# EAGLE design lightplay2 (EAGLE 7.2.0)
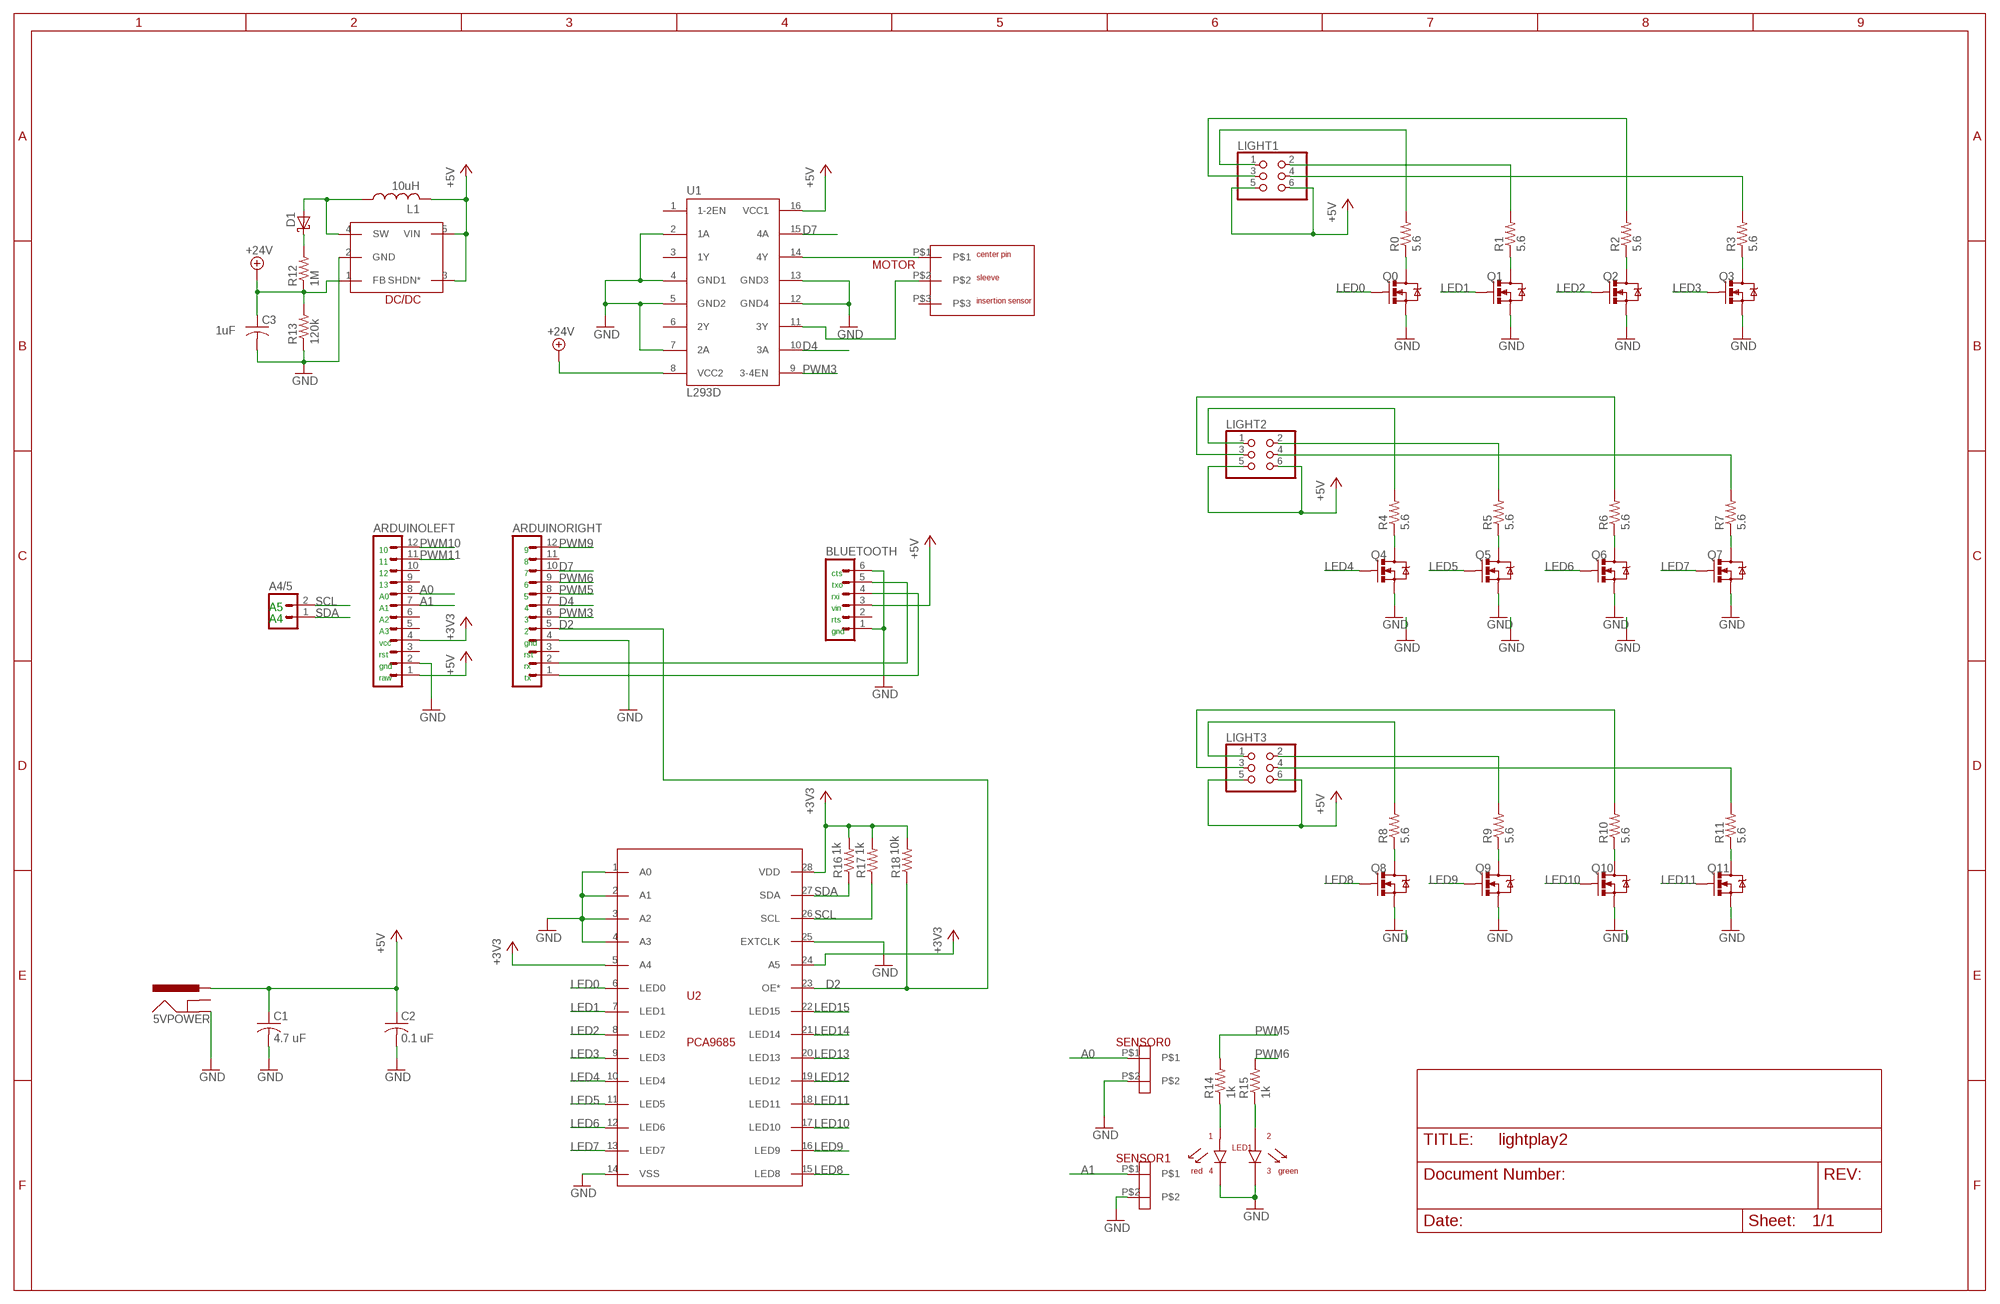
[diagram p0: schematic, sheet 1]

## Parts
5VPOWER  POWER_JACKPTH  [POWER_JACK_PTH]
A4/5  M02PTH  [1X02]
ARDUINOLEFT  M12PTH  [1X12]
ARDUINORIGHT  M12PTH  [1X12]
BLUETOOTH  M06SILK_FEMALE_PTH  [1X06]
C1  4.7 uF  C-USC1206  [C1206]
C2  0.1 uF  C-USC1206  [C1206]
C3  1uF  C-USC1206  [C1206]
D1  B120_SHOTTKY_DIODE  [DO214AC]
DC/DC  LT1615  [SOT23-5]
L1  10uH  INDUCTOR_WURTH  [INDUCTOR_WURTH]
LED1  BICOLOR_LED  [BICOLOR_LED]
LIGHT1  PINHD-2X3  [2X03]
LIGHT2  PINHD-2X3  [2X03]
LIGHT3  PINHD-2X3  [2X03]
MOTOR  PJ-075DH-SMT-TR  [PJ-075DH-SMT-TR]
Q0  MOSFET-NCHANNELAO3404A  [SOT23-3]
Q1  MOSFET-NCHANNELAO3404A  [SOT23-3]
Q2  MOSFET-NCHANNELAO3404A  [SOT23-3]
Q3  MOSFET-NCHANNELAO3404A  [SOT23-3]
Q4  MOSFET-NCHANNELAO3404A  [SOT23-3]
Q5  MOSFET-NCHANNELAO3404A  [SOT23-3]
Q6  MOSFET-NCHANNELAO3404A  [SOT23-3]
Q7  MOSFET-NCHANNELAO3404A  [SOT23-3]
Q8  MOSFET-NCHANNELAO3404A  [SOT23-3]
Q9  MOSFET-NCHANNELAO3404A  [SOT23-3]
Q10  MOSFET-NCHANNELAO3404A  [SOT23-3]
Q11  MOSFET-NCHANNELAO3404A  [SOT23-3]
R0  5.6  R-US_0207/10  [0207/10]
R1  5.6  R-US_0207/10  [0207/10]
R2  5.6  R-US_0207/10  [0207/10]
R3  5.6  R-US_0207/10  [0207/10]
R4  5.6  R-US_0207/10  [0207/10]
R5  5.6  R-US_0207/10  [0207/10]
R6  5.6  R-US_0207/10  [0207/10]
R7  5.6  R-US_0207/10  [0207/10]
R8  5.6  R-US_0207/10  [0207/10]
R9  5.6  R-US_0207/10  [0207/10]
R10  5.6  R-US_0207/10  [0207/10]
R11  5.6  R-US_0207/10  [0207/10]
R12  1M  R-US_R0805  [R0805]
R13  120k  R-US_R0805  [R0805]
R14  1k  R-US_R0805  [R0805]
R15  1k  R-US_R0805  [R0805]
R16  1k  R-US_R0805  [R0805]
R17  1k  R-US_R0805  [R0805]
R18  10k  R-US_R0805  [R0805]
SENSOR0  3.5MM_2PIN_SCREWTERMINAL_SPARKFUN  [1X02_3.5_SCREWTERM]
SENSOR1  3.5MM_2PIN_SCREWTERMINAL_SPARKFUN  [1X02_3.5_SCREWTERM]
U1  L293D  [DIL16]
U2  PCA9685  [TSSOP28]

## Nets
+3V3: ARDUINOLEFT.4 R16.2 R17.2 R18.2 U2.5(A4) U2.24(A5) U2.28(VDD)
+5V [power]: 5VPOWER.PWR ARDUINOLEFT.1 BLUETOOTH.3 C1.1 C2.1 DC/DC.3(SHDN*) DC/DC.5(VIN) L1.P$2 LIGHT1.5 LIGHT1.6 LIGHT2.5 LIGHT2.6 LIGHT3.5 LIGHT3.6 U1.16(VCC1)
+24V [power]: C3.1 DC/DC.1(FB) R12.1 R13.2 U1.8(VCC2)
A0: ARDUINOLEFT.8 SENSOR0.P$1
A1: ARDUINOLEFT.7 SENSOR1.P$1
D2: ARDUINORIGHT.5 R18.1 U2.23(OE*)
D4: ARDUINORIGHT.7 U1.10(3A)
D7: ARDUINORIGHT.10 U1.15(4A)
GND [power]: 5VPOWER.GND ARDUINOLEFT.2 ARDUINORIGHT.4 BLUETOOTH.1 BLUETOOTH.6 C1.2 C2.2 C3.2 DC/DC.2(GND) Q0.2(S) Q1.2(S) Q2.2(S) Q3.2(S) Q4.2(S) Q5.2(S) Q6.2(S) Q7.2(S) Q8.2(S) Q9.2(S) Q10.2(S) Q11.2(S) R13.1 SENSOR0.P$2 SENSOR1.P$2 U1.2(1A) U1.4(GND1) U1.5(GND2) U1.7(2A) U1.12(GND4) U1.13(GND3) U2.1(A0) U2.2(A1) U2.3(A2) U2.4(A3) U2.14(VSS) U2.25(EXTCLK)
LED0: Q0.1(G) U2.6(LED0)
LED1: Q1.1(G) U2.7(LED1)
LED2: Q2.1(G) U2.8(LED2)
LED3: Q3.1(G) U2.9(LED3)
LED4: Q4.1(G) U2.10(LED4)
LED5: Q5.1(G) U2.11(LED5)
LED6: Q6.1(G) U2.12(LED6)
LED7: Q7.1(G) U2.13(LED7)
LED8: Q8.1(G) U2.15(LED8)
LED9: Q9.1(G) U2.16(LED9)
LED10: Q10.1(G) U2.17(LED10)
LED11: Q11.1(G) U2.18(LED11)
LED12: U2.19(LED12)
LED13: U2.20(LED13)
LED14: U2.21(LED14)
LED15: U2.22(LED15)
N$1 [power]: Q0.3(D) R0.1
N$2 [power]: Q1.3(D) R1.1
N$3 [power]: Q2.3(D) R2.1
N$4 [power]: MOTOR.P$1 U1.14(4Y)
N$5 [power]: MOTOR.P$2 U1.11(3Y)
N$7 [power]: D1.A DC/DC.4(SW) L1.P$1
N$8 [power]: LIGHT1.1 R0.2
N$9 [power]: Q3.3(D) R3.1
N$10 [power]: LIGHT1.2 R1.2
N$11: ARDUINORIGHT.2 BLUETOOTH.5
N$12: ARDUINORIGHT.1 BLUETOOTH.4
N$13 [power]: Q4.3(D) R4.1
N$14 [power]: LIGHT1.3 R2.2
N$15 [power]: LIGHT1.4 R3.2
N$16 [power]: Q5.3(D) R5.1
N$17 [power]: Q6.3(D) R6.1
N$18 [power]: Q7.3(D) R7.1
N$19 [power]: LIGHT2.1 R4.2
N$20 [power]: LIGHT2.2 R5.2
N$21 [power]: LIGHT2.3 R6.2
N$22 [power]: LIGHT2.4 R7.2
N$23 [power]: Q8.3(D) R8.1
N$24: Q9.3(D) R9.1
N$25 [power]: Q10.3(D) R10.1
N$26 [power]: Q11.3(D) R11.1
N$27 [power]: LIGHT3.1 R8.2
N$28: LIGHT3.2 R9.2
N$29 [power]: LIGHT3.3 R10.2
N$30 [power]: LIGHT3.4 R11.2
N$32: LED1.P$1 R14.1
N$33: D1.C R12.2
N$34: LED1.P$2 R15.1
PWM3: ARDUINORIGHT.6 U1.9(3-4EN)
PWM5: ARDUINORIGHT.8 R14.2
PWM6: ARDUINORIGHT.9 R15.2
PWM9: ARDUINORIGHT.12
PWM10: ARDUINOLEFT.12
PWM11: ARDUINOLEFT.11
SCL: A4/5.2 R17.1 U2.26(SCL)
SDA: A4/5.1 R16.1 U2.27(SDA)
Unconnected: 5VPOWER.GNDBREAK ARDUINOLEFT.3 ARDUINOLEFT.5 ARDUINOLEFT.6 ARDUINOLEFT.9 ARDUINOLEFT.10 ARDUINORIGHT.3 ARDUINORIGHT.11 BLUETOOTH.2 LED1.P$3 LED1.P$4 MOTOR.P$3 U1.1(1-2EN) U1.3(1Y) U1.6(2Y)

## Notes on the sheet
- 10 | 9
- 11 | 8
- 12 | 7 | cts
- 13 | 6 | txo
- A0 | 5 | rxi
- A5 | A1 | 4 | vin
- A4 | A2 | 3 | rts
- A3 | 2 | gnd
- vcc | gnd
- rst | rst
- gnd | rx
- raw | tx

## Library data of the parts
5VPOWER = SparkFun-Connectors:POWER_JACK: Power Jack This is the standard 5.5mm barrel jack for power. The PTH is the most common, proven, reliable, footprint. The Slot footprint only works if the mill layer is transmitted to the PCB fab house so be warned. Mating wall wart : TOL-00298 (and others); PROD_ID: CONN-08197
A4/5 = SparkFun-Connectors:M02: Standard 2-pin 0.1" header. Use with - straight break away headers ( PRT-00116) - right angle break away headers (PRT-00553) - swiss pins (PRT-00743) - machine pins (PRT-00117) - female headers (PRT-00115) Molex polarized connector foot print use with: PRT-08233 with associated crimp pins and housings. 2.54_SCREWTERM for use with PRT-10571. 3.5mm Screw Terminal footprints for PRT-08084 5mm Screw Terminal footprints for use with PRT-08432
ARDUINOLEFT ARDUINORIGHT = SparkFun-Connectors:M12: Header 12 Standard 12-pin 0.1" header. Use with straight break away headers (SKU : PRT-00116), right angle break away headers (PRT-00553), swiss pins (PRT-00743), machine pins (PRT-00117), and female headers (PRT-00115).
BLUETOOTH = SparkFun-Connectors:M06: Header 6 Standard 6-pin 0.1" header. Use with straight break away headers (SKU : PRT-00116), right angle break away headers (PRT-00553), swiss pins (PRT-00743), machine pins (PRT-00117), and female headers (PRT-00115). Molex polarized connector foot print use with SKU : PRT-08094 with associated crimp pins and housings. NOTES ON THE VARIANTS LOCK and LOCK_LONGPADS... This footprint was designed to help hold the alignment of a through-hole component (i.e. 6-pin header) while soldering it into place. You may notice that each hole has been shifted either up or down by 0.005 of an inch from it's more standard position (which is a perfectly straight line). This slight alteration caused the pins (the squares in the middle) to touch the edges of the holes. Because they are alternating, it causes a "brace" to hold the component in place. 0.005 has proven to be the perfect amount of "off-center" position when using our standard breakaway headers. Although looks a little odd when you look at the bare footprint, once you have a header in there, the alteration is very hard to notice. Also,if you push a header all the way into place, it is covered up entirely on the bottom side. This idea of altering the position of holes to aid alignment will be further integrated into the Sparkfun Library for other footprints. It can help hold any component with 3 or more connection pins.; PROD_ID: CONN-08437
C1-C3 = resistor:C-US: CAPACITOR, American symbol
D1 = robbie:B120_SHOTTKY_DIODE
DC/DC = robbie:LT1615
L1 = robbie:INDUCTOR_WURTH
LED1 = robbie:BICOLOR_LED
LIGHT1-LIGHT3 = SparkFun-Connectors:PINHD-2X3: PIN HEADER
MOTOR = robbie:PJ-075DH-SMT-TR
Q0 Q1-Q11 = SparkFun-DiscreteSemi:MOSFET-NCHANNEL: Common NMOSFET Parts MFG P/N Store ID Prod ID FDD8780 TRANS-09984 SI7820DN TRANS-11055 FDS6630A IC-08089 2N7002PW TRANS-11151 FQP30N06L COM-10213 TRANS-10060 BSS123LT1G TRANS-08345 BSS138 TRANS-00830 BS170 2N7000; PROD_ID: TRAN-12988
R0 R1-R18 = resistor:R-US_: RESISTOR, American symbol
SENSOR0 SENSOR1 = robbie:3.5MM_2PIN_SCREWTERMINAL_SPARKFUN
U1 = st-microelectronics:L293D: PUSH-PULL 4 CHANNEL DRIVER; MPN: L293D; OC_FARNELL: 9589619; OC_NEWARK: 56P8249
U2 = robbie:PCA9685

## Net classes
0 default: width 0.254 mm, clearance 0.203 mm
1 power: width 0.508 mm, clearance 0.254 mm

## Board
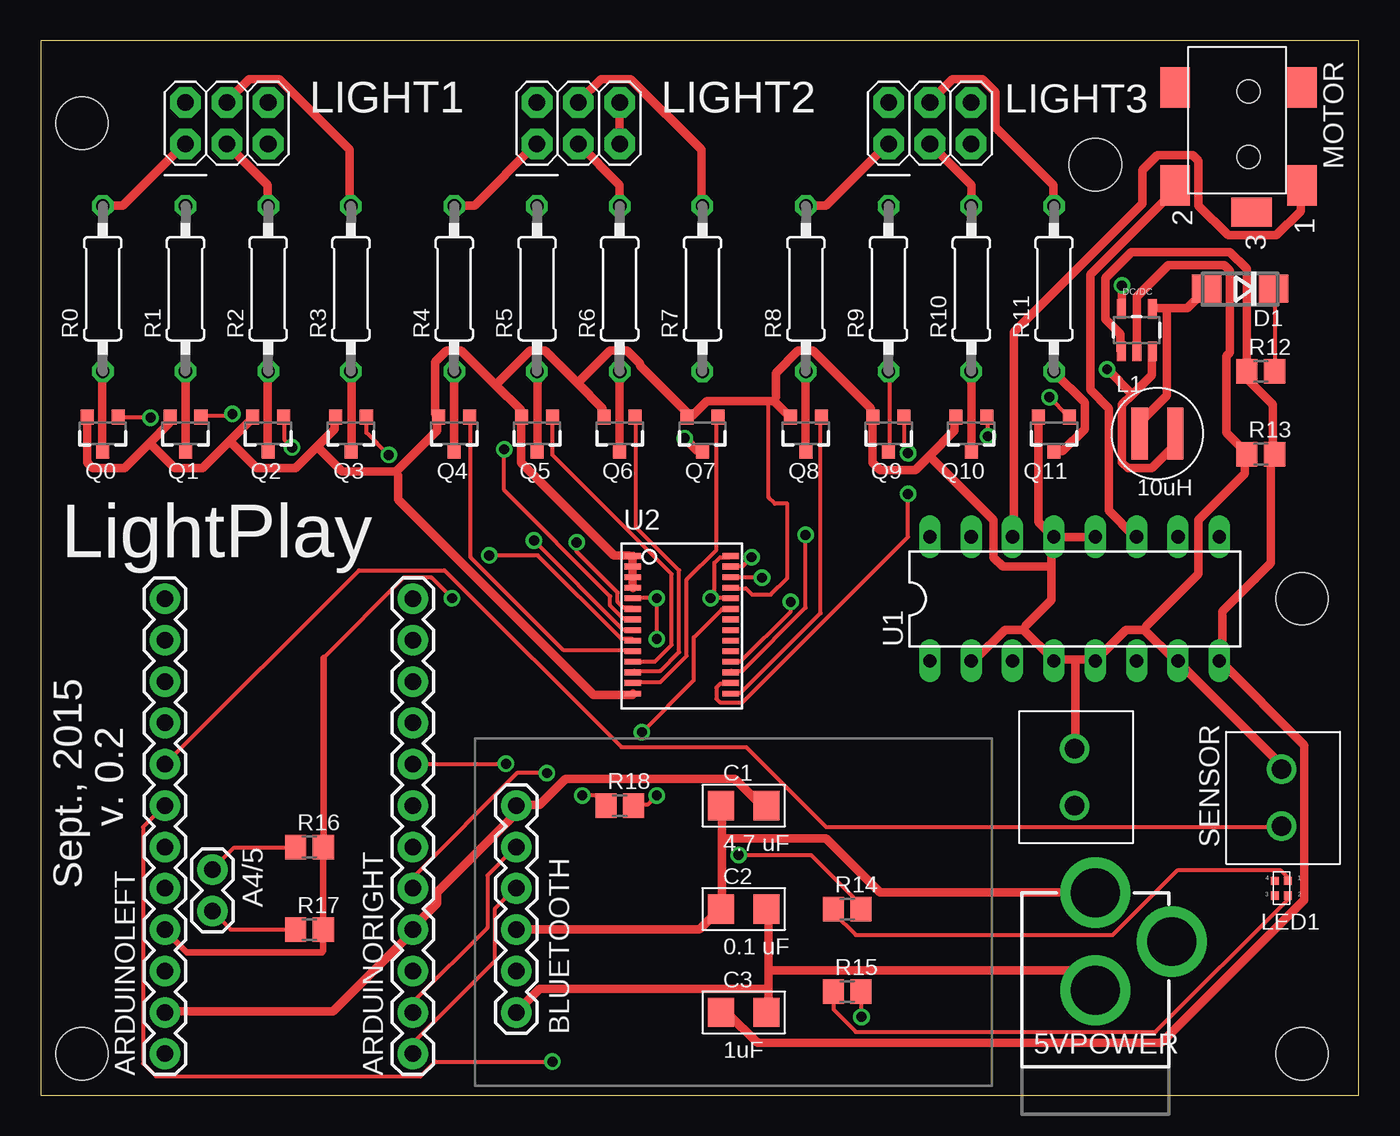
[diagram p1: board, top side]
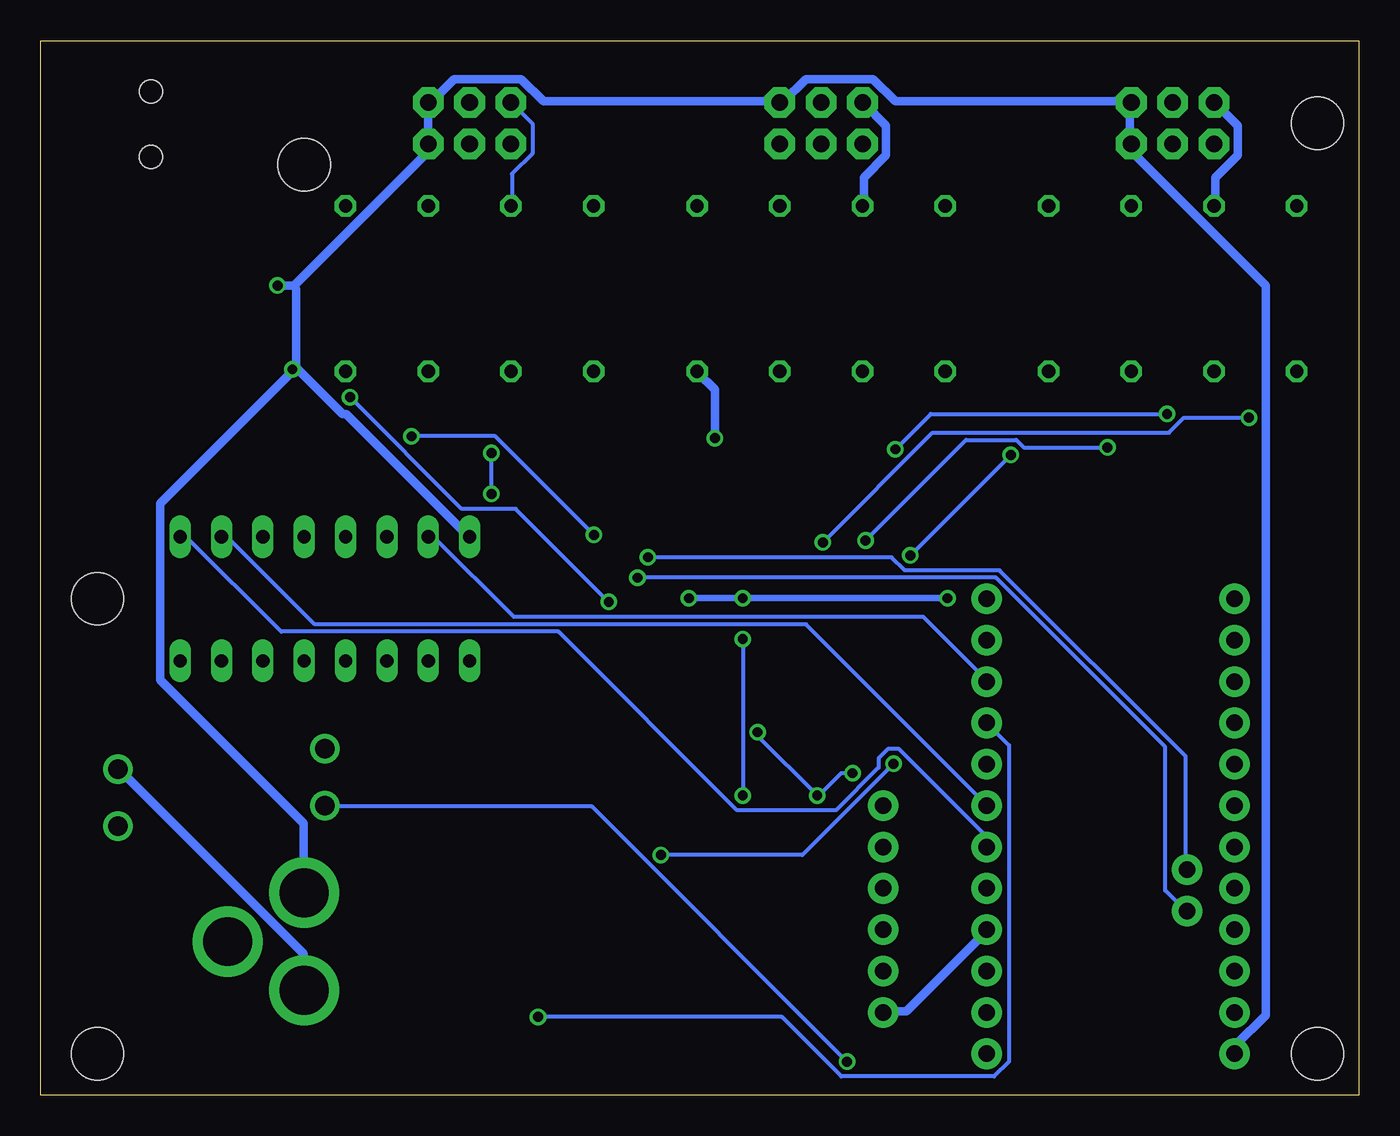
[diagram p2: board, bottom side, seen from below]

Size 80.95 x 64.76 mm. Coordinates in mm from the lower left corner, seen from the top.
Outline: 0,0 80.95,0 80.95,64.76 0,64.76 0,0
Copper layers (1*16): Top 0.035mm / dielectric 1.5mm / Bottom 0.035mm
Design rules "default": minimum track width 10mil, minimum drill 24mil, track to track 8mil, track to pad 8mil, pad to pad 8mil, via to via 8mil, smd to smd 8mil, copper to edge 40mil, drill to drill 8mil, minimum pad ring 10mil, minimum via ring 8mil, stop-mask expansion 4mil, vias tented up to drill 0mil, thermal gap 10mil
Holes 3.2 mm at 2.54,2.54 2.54,59.69 77.47,2.54 64.77,57.15 77.47,30.48

### Footprints (pad centres in the part's own frame; a part is rotated, then mirrored left to right if it is on the bottom)
POWER_JACK_PTH = drill 2.997 pad 4.318: GND 0,7.7; GNDBREAK 4.7,10.7; PWR 0,13.7
1X02 = drill 1.016 pad 1.88: 1 0,0; 2 2.54,0
1X12 = drill 1.016 pad 1.88: 1 0,0; 2 2.54,0; 3 5.08,0; 4 7.62,0; 5 10.16,0; 6 12.7,0; 7 15.24,0; 8 17.78,0; 9 20.32,0; 10 22.86,0; 11 25.4,0; 12 27.94,0
1X06 = drill 1.016 pad 1.88: 1 0,0; 2 2.54,0; 3 5.08,0; 4 7.62,0; 5 10.16,0; 6 12.7,0
C1206 = smd 1.6 x 1.8: 1 -1.4,0; 2 1.4,0
DO214AC = smd 1.8 x 1.7: A 2.05,0; C -2.05,0
SOT23-5 = smd 0.55 x 1.2: 1 -0.95,-1.3; 2 0,-1.3; 3 0.95,-1.3; 4 0.95,1.3; 5 -0.95,1.3
INDUCTOR_WURTH = smd 1 x 3.2: P$1 -1.1,0; P$2 1.1,0
BICOLOR_LED = smd 0.5 x 0.5: P$1 0.4,0.45; P$2 0.4,-0.45; P$3 -0.4,-0.45; P$4 -0.4,0.45
2X03 = drill 1.016 pad 1.88 octagon: 1 -2.54,-1.27; 2 -2.54,1.27; 3 0,-1.27; 4 0,1.27; 5 2.54,-1.27; 6 2.54,1.27
PJ-075DH-SMT-TR = smd 2.5 x 1.8: P$1 0,0; P$2 0,-7.8; P$4 -6,0; P$5 -6,-7.8 | smd 1.8 x 2.5: P$3 1.65,-3.1 | hole 1.4: -5.75,-3.3; -1.75,-3.3
SOT23-3 = smd 0.8 x 0.9: 1 -0.95,-1; 2 0.95,-1; 3 0,1.1
0207/10 = drill 0.813 octagon: 1 -5.08,0; 2 5.08,0
R0805 = smd 1.3 x 1.5: 1 -0.85,0; 2 0.85,0
1X02_3.5_SCREWTERM = drill 1.2: P$1 0,0; P$2 3.5,0
DIL16 = drill 0.813 long: 1 -8.89,-3.81; 2 -6.35,-3.81; 3 -3.81,-3.81; 4 -1.27,-3.81; 5 1.27,-3.81; 6 3.81,-3.81; 7 6.35,-3.81; 8 8.89,-3.81; 9 8.89,3.81; 10 6.35,3.81; 11 3.81,3.81; 12 1.27,3.81; 13 -1.27,3.81; 14 -3.81,3.81; 15 -6.35,3.81; 16 -8.89,3.81
TSSOP28 = smd 0.35 x 1: 1 -3.9,-3; 2 -3.25,-3; 3 -2.6,-3; 4 -1.95,-3; 5 -1.3,-3; 6 -0.65,-3; 7 0,-3; 8 0.65,-3; 9 1.3,-3; 10 1.95,-3; 11 2.6,-3; 12 3.25,-3; 13 3.9,-3; 14 4.55,-3; 15 4.55,3; 16 3.9,3; 17 3.25,3; 18 2.6,3; 19 1.95,3; 20 1.3,3; 21 0.65,3; 22 0,3; 23 -0.65,3; 24 -1.3,3; 25 -1.95,3; 26 -2.6,3; 27 -3.25,3; 28 -3.9,3

### Placement (x,y rotation side)
5VPOWER  64.77,-1.27 0 top
A4/5  10.54,13.84 270 top
ARDUINOLEFT  7.62,2.54 90 top
ARDUINORIGHT  22.86,2.54 90 top
BLUETOOTH  29.21,5.08 90 top
C1  43.18,17.78 0 top
C2  43.18,11.43 0 top
C3  43.18,5.08 0 top
D1  73.66,49.53 180 top
DC/DC  67.31,46.99 0 top
L1  68.58,40.64 0 top
LED1  76.2,12.7 0 top
LIGHT1  11.43,59.69 0 top
LIGHT2  33.02,59.69 0 top
LIGHT3  54.61,59.69 0 top
MOTOR  77.47,55.88 270 top
Q0  3.81,40.64 180 top
Q1  8.89,40.64 180 top
Q2  13.97,40.64 180 top
Q3  19.05,40.64 180 top
Q4  25.4,40.64 180 top
Q5  30.48,40.64 180 top
Q6  35.56,40.64 180 top
Q7  40.64,40.64 180 top
Q8  46.99,40.64 180 top
Q9  52.07,40.64 180 top
Q10  57.15,40.64 180 top
Q11  62.23,40.64 180 top
R0  3.81,49.53 90 top
R1  8.89,49.53 90 top
R2  13.97,49.53 90 top
R3  19.05,49.53 90 top
R4  25.4,49.53 90 top
R5  30.48,49.53 90 top
R6  35.56,49.53 90 top
R7  40.64,49.53 90 top
R8  46.99,49.53 90 top
R9  52.07,49.53 90 top
R10  57.15,49.53 90 top
R11  62.23,49.53 90 top
R12  74.93,44.45 0 top
R13  74.93,39.37 0 top
R14  49.53,11.43 0 top
R15  49.53,6.35 0 top
R16  16.51,15.24 0 top
R17  16.51,10.16 0 top
R18  35.56,17.78 0 top
SENSOR0  76.2,16.51 90 top
SENSOR1  63.5,17.78 90 top
U1  63.5,30.48 0 top
U2  39.37,29.21 270 top

### Tracks (layer width: path | path; a pad name or v marks a point on that pad's centre or on a via)
+3V3  (via drill 0.61)
  Top 0.254: 17.37,10.17 R17.2 | 17.37,15.2 R16.2 17.37,15.32 | 7.54,10.17 ARDUINOLEFT.4 | U2.5 36.46,30.52 v37.83,30.52 v37.83,28 | U2.24 42.29,30.52 v41.15,30.52 41.38,30.63 41.38,32.69 41.72,33.03 42.29,33.03 U2.28 | v37.83,18.4 37.26,17.83 36.46,17.83 R18.2 | 17.37,26.86 22.29,31.77 24,31.77 v25.26,30.52
  Top 0.406: 7.54,10.17 8.95,8.76 17.27,8.76 17.36,8.85 R17.2 R16.2 | 17.37,15.32 17.37,26.86
  Bottom 0.254: v37.83,28 v37.83,18.4
  Bottom 0.406: v25.26,30.52 v37.83,30.52 v41.15,30.52
+5V  (via drill 0.61)
  Top 0.508: 41.83,15.77 41.83,17.72 C1.1 | 41.83,15.77 41.83,11.43 C2.1 41.6,11.32 40.46,10.17 29.26,10.17 BLUETOOTH.3 | 41.83,15.77 48.23,15.77 51.55,12.46 64.69,12.46 5VPOWER.PWR | 67.04,43.03 66.41,42.41 66.41,38.86 66.75,38.52 68.24,38.52 69.61,39.89 69.61,40.58 L1.P$2 | 67.04,43.03 68.24,44.23 68.24,45.61 DC/DC.3 | LIGHT2.5 35.55,58.52 35.55,60.92 LIGHT2.6 | v66.41,49.72 66.41,48.35 DC/DC.5 | v65.49,44.58 67.04,43.03
  Bottom 0.508: ARDUINOLEFT.1 7.54,2.63 7.54,3.09 5.71,4.92 5.71,49.72 13.95,57.95 13.95,58.41 LIGHT1.5 14.06,58.64 14.06,60.92 LIGHT1.6 14.29,61.04 28.46,61.04 29.83,62.41 33.95,62.41 35.32,61.04 LIGHT2.6 35.66,61.04 50.06,61.04 51.44,62.41 55.55,62.41 56.92,61.04 LIGHT3.6 LIGHT3.5 57.15,57.95 65.38,49.72 | 65.38,49.72 v66.41,49.72 | 65.27,44.69 62.41,41.83 62.18,41.83 54.63,34.29 U1.16 | 65.27,44.69 65.27,49.49 65.38,49.72 | 65.27,44.69 v65.49,44.58 65.61,44.35 73.61,36.35 73.61,25.49 64.81,16.69 64.81,12.46 5VPOWER.PWR
+24V
  Top 0.508: DC/DC.1 66.29,45.72 66.29,46.75 65.38,47.66 65.38,50.18 66.98,51.78 73.04,51.78 74.07,50.75 74.07,44.46 R12.1 74.18,44.23 74.18,43.89 75.67,42.41 75.67,39.43 R13.2 75.55,39.2 75.55,32.69 72.58,29.72 72.58,26.86 U1.8 72.47,26.63 77.61,21.49 77.61,12 68.81,3.2 44.01,3.2 42.18,5.03 41.83,5.03 C3.1
A0
  Top 0.254: SENSOR0.P$1 76.12,16.46 48.23,16.46 43.32,21.37 35.66,21.37 24.8,32.23 19.55,32.23 7.66,20.34 ARDUINOLEFT.8
A1  (via drill 0.61)
  Top 0.254: v31.43,2.06 24.23,2.06 23.32,1.14 7.09,1.14 6.29,1.94 6.29,16.46 7.54,17.72 ARDUINOLEFT.7
  Bottom 0.254: v31.43,2.06 47.09,17.72 63.44,17.72 SENSOR1.P$1
D2  (via drill 0.61)
  Top 0.254: v36.92,22.29 40.12,25.49 40.12,28.12 41.83,29.83 42.29,29.83 U2.23 | v33.26,18.4 34.06,18.4 34.63,17.83 R18.1 | ARDUINORIGHT.5 22.86,13.37 29.26,19.77 v31.09,19.77
  Bottom 0.254: v36.92,22.29 36.92,22.06 v33.26,18.4 33.15,18.4 31.77,19.77 v31.09,19.77
D4
  Bottom 0.254: U1.10 69.49,34.29 64.12,28.92 33.95,28.92 22.86,17.83 ARDUINORIGHT.7
D7
  Bottom 0.254: U1.15 56.81,34.29 51.89,29.38 26.75,29.38 22.86,25.49 ARDUINORIGHT.10
GND
  Top 0.254: U2.25 42.41,31.11 43.31,31.11 43.69,30.73 44.83,30.73 45.85,31.75 45.85,36.32 45.09,36.32 44.7,36.7 44.7,42.63
  Top 0.508: 54.58,39.26 56.12,40.8 56.12,41.6 Q10.2 | 54.58,39.26 53.72,38.41 51.55,38.41 51.09,38.86 51.09,41.6 Q9.2 50.98,41.83 50.98,42.18 47.43,45.72 46.52,45.72 45.15,44.35 45.15,42.86 45.03,42.63 | 45.03,42.63 44.7,42.63 40.92,42.63 40.01,41.72 39.78,41.72 Q7.2 39.66,41.95 36.8,44.81 36.8,44.92 36.01,45.72 34.98,45.72 32.98,43.72 | 45.03,42.63 45.95,41.72 Q8.2 | 36.35,31.77 36.35,31.2 U2.4 | 36.35,31.77 U2.3 | 36.35,31.77 36.35,32.35 U2.2 36.35,32.69 36.35,33.03 U2.1 36.12,33.15 35.2,33.15 29.49,38.86 29.49,41.49 Q5.2 29.49,41.72 29.49,42.06 27.95,43.6 | 6.69,40.06 7.89,41.26 7.89,41.6 Q1.2 | 6.69,40.06 5.14,38.52 3.2,38.52 2.86,38.86 2.86,41.6 Q0.2 | 11.6,40.18 9.94,38.52 8.23,38.52 6.69,40.06 | 11.6,40.18 12.92,41.49 12.92,41.6 Q2.2 | 16.97,39.83 15.66,38.52 13.26,38.52 11.6,40.18 | 16.97,39.83 18.06,40.92 18.06,41.6 Q3.2 | 21.83,38.29 24.35,40.8 24.35,41.6 Q4.2 24.23,41.83 24.23,45.03 24.92,45.72 25.83,45.72 27.95,43.6 | 21.83,38.29 18.52,38.29 16.97,39.83 | 32.98,43.72 30.98,45.72 30.06,45.72 27.95,43.6 | 32.98,43.72 34.52,42.18 34.52,41.72 Q6.2 | U2.14 36.35,24.57 33.95,24.57 21.95,36.58 21.95,38.06 21.83,38.29 | C1.2 44.58,17.83 44.23,17.83 42.63,19.43 32.23,19.43 30.63,17.83 29.26,17.83 BLUETOOTH.6 29.03,17.6 29.03,17.14 24.35,12.46 24.35,11.77 22.97,10.4 ARDUINORIGHT.4 22.86,10.06 17.95,5.14 7.66,5.14 ARDUINOLEFT.2 | 44.69,7.66 44.69,11.43 C2.2 | 44.69,7.66 44.69,6.51 | 44.69,6.51 44.69,5.14 C3.2 | 44.69,6.51 30.63,6.51 29.26,5.14 BLUETOOTH.1 | DC/DC.2 67.32,45.72 67.32,49.03 69.27,50.98 72.69,50.98 73.04,50.63 73.04,45.61 72.81,45.38 72.81,40.69 74.07,39.43 R13.1 73.95,39.2 73.95,38.18 71.09,35.32 71.09,32 67.89,28.8 67.78,28.57
  Top 0.508: Q11.2 61.27,41.6 61.27,35.2 62.18,34.29 U1.13 | U1.13 U1.12 | 60.35,28.57 59.21,28.57 57.38,26.75 57.15,26.75 U1.2 | 60.35,28.57 62.18,26.75 U1.4 62.41,26.75 63.55,26.75 | 63.55,26.75 64.69,26.75 U1.5 64.92,26.86 66.64,28.57 67.78,28.57 | 67.78,28.57 69.61,26.75 69.84,26.75 U1.7 69.95,26.52 76.12,20.34 76.12,20.12 SENSOR0.P$2 | 63.55,26.75 63.55,21.37 SENSOR1.P$2 | 62.06,32.46 62.06,30.4 60.47,28.8 60.35,28.57 | 62.06,32.46 62.06,34.06 U1.13 | 44.69,7.66 63.55,7.66 64.69,6.51 5VPOWER.GND | 54.58,39.26 58.52,35.32 58.52,33.03 59.09,32.46 62.06,32.46
  Bottom 0.508: BLUETOOTH.1 29.15,5.14 27.77,5.14 22.86,10.06 ARDUINORIGHT.4 | 5VPOWER.GND 64.81,6.51 64.81,8.69 76.12,20 SENSOR0.P$2
LED0  (via drill 0.61)
  Top 0.254: v6.74,41.6 4.8,41.6 Q0.1 | v32.92,33.95 32.92,33.38 35.43,30.86 35.43,30.29 35.78,29.95 36.35,29.95 U2.6
  Bottom 0.254: v6.74,41.6 10.74,41.6 11.66,40.69 26.18,40.69 v32.92,33.95
LED1  (via drill 0.61)
  Top 0.254: v11.77,41.83 11.66,41.72 9.94,41.72 Q1.1 | v28.46,39.66 28.46,37.15 34.98,30.63 34.98,30.06 35.78,29.26 36.35,29.26 U2.7
  Bottom 0.254: v11.77,41.83 26.29,41.83 v28.46,39.66
LED2  (via drill 0.61)
  Top 0.254: v15.43,39.78 14.97,40.23 14.97,41.6 Q2.1 | v30.29,34.06 35.78,28.57 36.35,28.57 U2.8
  Bottom 0.254: v15.43,39.78 20.57,39.78 21.03,40.23 24.12,40.23 v30.29,34.06
LED3  (via drill 0.61)
  Top 0.254: v21.37,39.32 20,40.69 20,41.6 Q3.1 | v27.55,33.15 30.52,33.15 35.66,28 36.35,28 U2.9
  Bottom 0.254: v27.55,33.15 v21.37,39.32
LED4
  Top 0.254: Q4.1 26.4,41.6 26.4,33.03 32.12,27.32 36.35,27.32 U2.10
LED5
  Top 0.254: Q5.1 31.43,41.6 31.43,39.32 38.75,32 38.75,27.66 37.72,26.63 36.46,26.63 U2.11
LED6
  Top 0.254: Q6.1 36.58,41.6 36.58,34.86 39.2,32.23 39.2,27.2 38.06,26.06 36.46,26.06 U2.12
LED7
  Top 0.254: Q7.1 41.49,41.6 41.49,33.49 39.66,31.66 39.66,26.98 38.06,25.38 36.46,25.38 U2.13
LED8
  Top 0.254: Q8.1 47.89,41.6 47.89,29.6 42.98,24.69 42.41,24.69 U2.15
LED9  (via drill 0.61)
  Top 0.254: v53.26,39.43 53.03,39.66 53.03,41.6 Q9.1 | v53.26,36.92 53.26,34.29 43.09,24.12 41.72,24.12 41.49,24.35 41.49,25.03 41.72,25.26 42.29,25.26 U2.16
  Bottom 0.254: v53.26,36.92 v53.26,39.43
LED10  (via drill 0.61)
  Top 0.254: v58.18,40.46 58.18,41.6 Q10.1 | v46.98,34.4 46.98,29.95 43.09,26.06 42.41,26.06 U2.17
  Bottom 0.254: v58.18,40.46 53.03,40.46 v46.98,34.4
LED11  (via drill 0.61)
  Top 0.254: v61.95,42.86 63.09,41.72 Q11.1 | v46.06,30.29 46.06,29.72 42.98,26.63 42.41,26.63 U2.18
  Bottom 0.254: v61.95,42.86 55.09,36.01 51.78,36.01 v46.06,30.29
N$1
  Top 0.508: Q0.3 3.77,39.55 3.77,44.35 R0.1
N$2
  Top 0.508: Q1.3 8.91,39.55 8.91,44.35 R1.1
N$3
  Top 0.508: Q2.3 13.95,39.55 13.95,44.35 R2.1
N$4
  Top 0.508: MOTOR.P$1 77.38,55.78 77.38,54.29 75.89,52.81 72.92,52.81 71.09,54.63 71.09,57.38 70.75,57.72 68.58,57.72 67.67,56.81 67.67,54.75 59.78,46.86 59.78,34.29 U1.14
N$5
  Top 0.508: MOTOR.P$2 69.61,55.78 69.61,55.55 64.47,50.41 64.47,43.32 65.61,42.18 65.61,35.89 67.21,34.29 U1.11
N$7
  Top 0.508: 69.15,48.35 70.41,48.35 71.55,49.49 D1.A | 69.15,48.35 68.35,48.35 DC/DC.4 | 69.15,48.35 69.15,42.98 67.55,41.38 67.55,40.69 L1.P$1
N$8
  Top 0.508: R0.2 3.89,54.63 5.03,54.63 8.8,58.41 LIGHT1.1
N$9
  Top 0.508: Q3.3 19.09,39.55 19.09,44.35 R3.1
N$10
  Bottom 0.508: R1.2 8.8,54.63 8.8,56.35 7.43,57.72 7.43,59.55 8.8,60.92 LIGHT1.2
N$11
  Top 0.254: ARDUINORIGHT.2 22.86,5.71 27.43,10.29 27.43,13.49 29.15,15.2 BLUETOOTH.5
N$12
  Top 0.254: ARDUINORIGHT.1 22.86,3.2 27.89,8.23 27.89,11.43 29.15,12.69 BLUETOOTH.4
N$13
  Top 0.508: Q4.3 25.38,39.55 25.38,44.35 R4.1
N$14
  Top 0.508: R2.2 13.95,54.63 13.95,55.89 11.43,58.41 LIGHT1.3
N$15
  Top 0.508: R3.2 18.97,54.63 18.97,58.06 14.63,62.41 12.8,62.41 11.43,61.04 LIGHT1.4
N$16
  Top 0.508: Q5.3 30.52,39.55 30.52,44.35 R5.1
N$17
  Top 0.508: Q6.3 35.55,39.55 35.55,44.35 R6.1
N$18  (via drill 0.61)
  Top 0.508: v39.55,40.35 40.35,39.55 40.58,39.55 Q7.3
  Bottom 0.508: v39.55,40.35 39.55,43.32 40.58,44.35 R7.1
N$19
  Top 0.508: R4.2 25.49,54.63 26.63,54.63 30.4,58.41 LIGHT2.1
N$20
  Bottom 0.508: R5.2 30.4,54.63 30.4,56.35 29.03,57.72 29.03,59.55 30.4,60.92 LIGHT2.2
N$21
  Top 0.508: LIGHT2.3 35.55,55.89 35.55,54.63 R6.2
N$22
  Top 0.508: R7.2 40.58,54.63 40.58,58.06 36.23,62.41 34.4,62.41 33.03,61.04 LIGHT2.4
N$23
  Top 0.508: Q8.3 46.98,39.55 46.98,44.35 R8.1
N$24
  Top 0.254: Q9.3 52.12,39.55 52.12,44.35 R9.1
N$25
  Top 0.508: R10.1 Q10.3
N$26
  Top 0.508: Q11.3 62.29,39.55 62.75,39.55 64.12,40.92 64.12,42.52 62.29,44.35 R11.1
N$27
  Top 0.508: R8.2 47.09,54.63 48.23,54.63 52.01,58.41 LIGHT3.1
N$28
  Bottom 0.254: R9.2 52.01,54.63 52.01,56.58 50.75,57.84 50.75,59.66 52.01,60.92 LIGHT3.2
N$29
  Top 0.508: R10.2 57.15,55.89 54.63,58.41 LIGHT3.3
N$30
  Top 0.508: R11.2 62.18,54.63 62.18,55.89 58.64,59.44 58.64,61.61 57.84,62.41 56.01,62.41 54.63,61.04 LIGHT3.4
N$32
  Top 0.254: LED1.P$1 76.58,13.26 76.58,13.37 76.12,13.83 69.84,13.83 65.84,9.83 50.06,9.83 48.69,11.2 48.69,11.43 R14.1
N$33
  Top 0.254: R12.2 75.78,44.46 75.78,49.49 D1.C
N$34
  Top 0.254: LED1.P$2 76.58,12.23 76.58,12 68.47,3.89 50.06,3.89 48.69,5.26 48.69,6.29 R15.1
PWM3
  Bottom 0.254: U1.9 72.01,34.29 66.18,28.46 49.15,28.46 38.18,17.49 32.12,17.49 29.49,20.12 29.49,20.69 28.92,21.26 28.23,21.26 22.86,15.89 ARDUINORIGHT.6
PWM5  (via drill 0.61)
  Top 0.254: v42.86,14.74 47.32,14.74 50.29,11.77 50.29,11.43 R14.2 | v28.57,20.34 22.86,20.34 ARDUINORIGHT.8
  Bottom 0.254: v42.86,14.74 34.18,14.74 v28.57,20.34
PWM6  (via drill 0.61)
  Top 0.254: v50.41,4.8 50.41,6.29 R15.2
  Bottom 0.254: v50.41,4.8 35.43,4.8 31.77,1.14 22.4,1.14 21.49,2.06 21.49,21.49 ARDUINORIGHT.9
SCL  (via drill 0.61)
  Top 0.254: v44.3,31.77 42.41,31.77 U2.26 | R17.1 15.66,10.17 11.66,10.17 10.63,11.2 A4/5.2
  Bottom 0.254: v44.3,31.77 22.29,31.77 11.89,21.37 11.89,12.57 10.63,11.32 A4/5.2
SDA  (via drill 0.61)
  Top 0.254: v43.66,33.03 43.09,32.46 42.41,32.46 U2.27 | R16.1 15.66,15.2 11.89,15.2 10.63,13.95 A4/5.1
  Bottom 0.254: v43.66,33.03 28.69,33.03 27.89,32.23 22.06,32.23 10.63,20.8 10.63,13.95 A4/5.1

### Text on the board
tPlace: LightPlay | v. 0.2 | SENSOR | Sept., 2015